# Altium schematic sheet BOC_CAN.SchDoc: Board-On-Chip CAN Interface
size A; Organization: Altium Limited; Address1: L3, 12a Rodborough Rd; Address2: Frenchs Forest; Address3: NSW; Address4: Australia 2086; Revision: 1.06; SheetNumber: 13; SheetTotal: 16
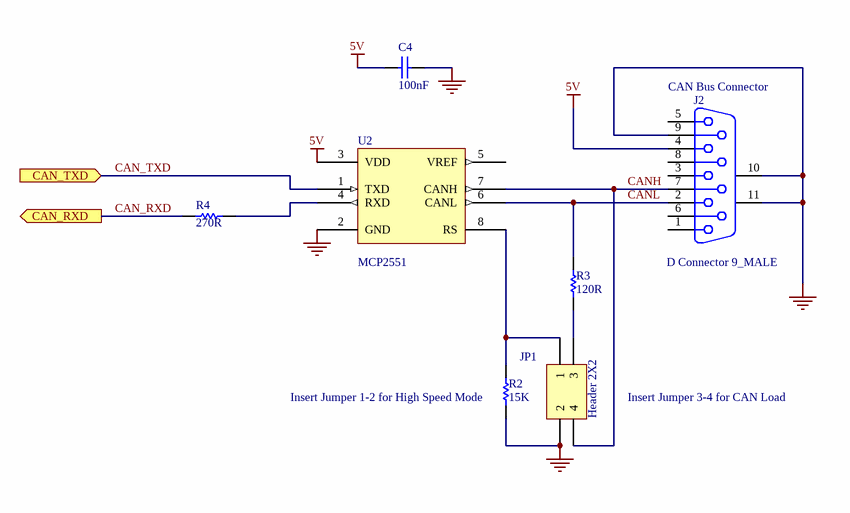
[diagram p0: BOC_CAN.SchDoc]

## Parts
C4  100nF  [CC2012-0805]
J2  D Connector 9_MALE  [DSUB1.9_MALE]
JP1  Header 2X2  [HDR2X2]
R2  15K  [CC2012-0805]
R3  120R  [CC2012-0805]
R4  270R  [CC2012-0805]
U2  MCP2551  [SOIC8]

## Ports
CAN_RXD (out), CAN_TXD (in)

## Nets
5V: C4.1 J2.4 U2.3(VDD)
GND: C4.2 J2.9 J2.10(MH1) J2.11(MH2) JP1.2 R2.1 U2.2(GND)
CAN_RXD: R4.1 ; port CAN_RXD
CAN_TXD: U2.1(TXD) ; port CAN_TXD
CANH: J2.7 JP1.4 U2.7(CANH)
CANL: J2.2 R3.2 U2.6(CANL)
NetJP1_1: JP1.1 R2.2 U2.8(RS)
NetJP1_3: JP1.3 R3.1
NetR4_2: R4.2 U2.4(RXD)

Not connected (* = marked no-connect by the designer): J2 1 3 5 6 8; U2 5(VREF)

## Notes on the sheet
- (near J2) CAN Bus Connector
- (near R2) Insert Jumper 1-2 for High Speed Mode
- Insert Jumper 3-4 for CAN Load
- Title
- Size:
- Date:
- A
- Number:
- Time:
- Revision:
- Sheet
- of
- File:

## Library data of the parts
C4 = CAP: Capacitor; Fitted: True
J2 = D Connector 9_MALE: Receptacle Assembly, 9 Position, Right Angle; Manufacturer: Generic Components; Package Information: Latest Revision: O; Positions: 9; Fitted: True; Published: 15-Jun-2001; Revision: July-2002: Re-released for DXP Platform.; Datasheet: (1-Sep-1999); Package Reference: 788750; Publisher: Altium Limited; Class I: Connector; Orientation: Right Angle; Gender: Receptacle
JP1 = Header 2X2: Header, 2-Pin, Dual row; Manufacturer: Generic Components; Class I: Connector; Fitted: True; Revision: July-2002: Re-released for DXP Platform.; Publisher: Altium Limited
R2-R4 = RES: Resistor; Fitted: True
U2 = MCP2551: High Speed Can Transceiver; Fitted: True